# Altium schematic sheet 03_CAN.SchDoc
size A; SheetNumber: 4; SheetTotal: 6
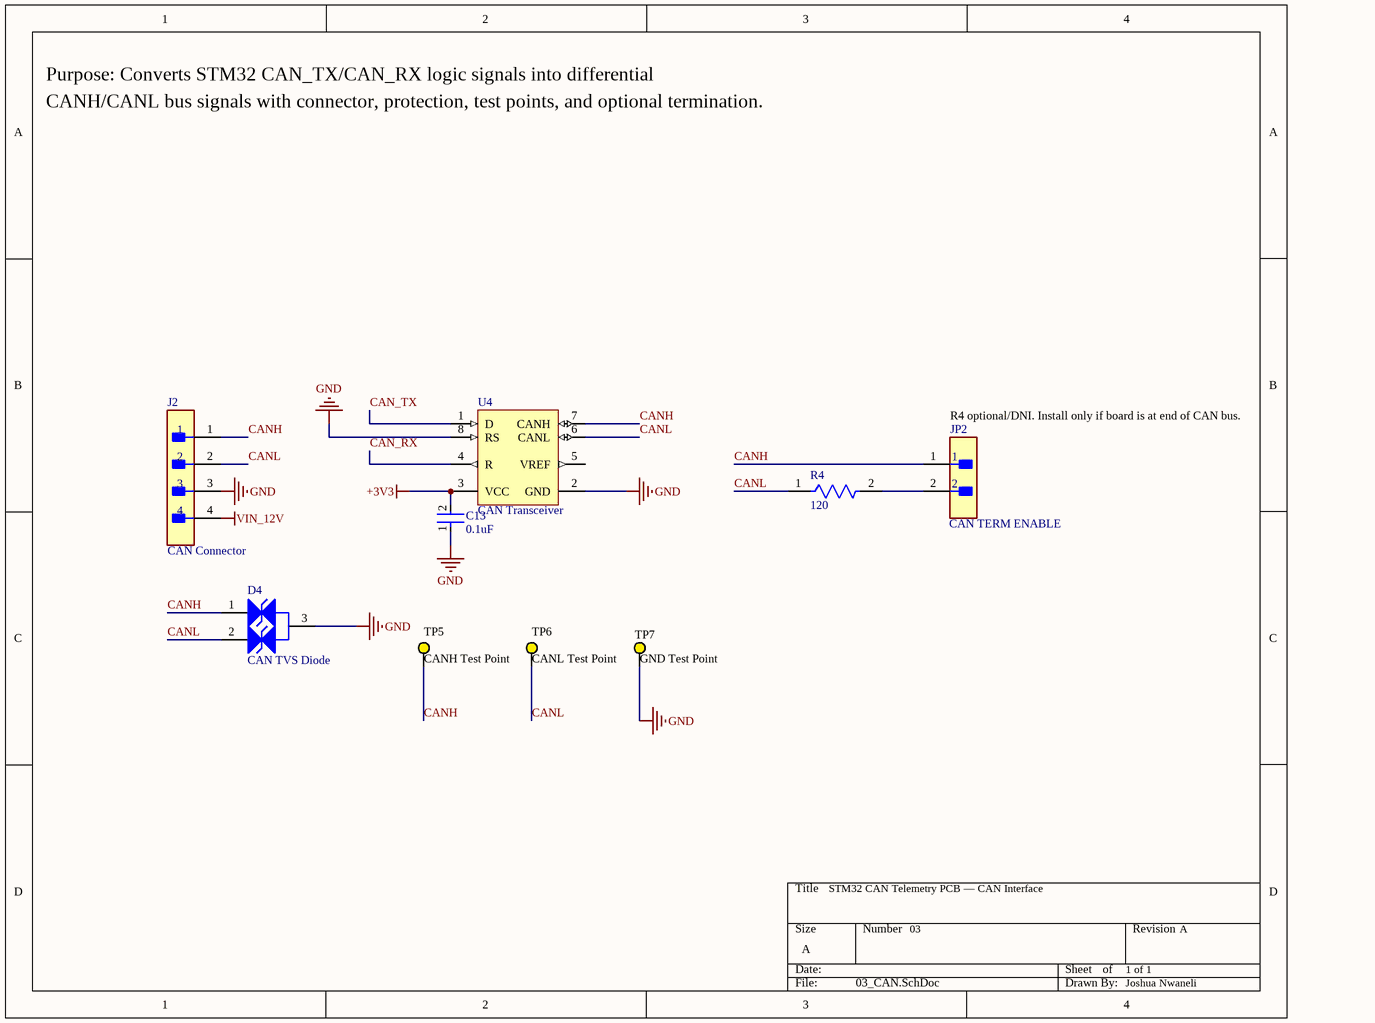
[diagram p0: 03_CAN.SchDoc]

## Parts
C13  0.1uF  [FP-CC0805-EB-MFG]
D4  CAN TVS Diode  [ONSC-SOT-23-3-318-08_V]
J2  CAN Connector  [FP-1777099-MFG]
JP2  CAN TERM ENABLE  [FP-TSW-102-12-T-S-MFG]
R4  120  [FP-RT0805-MFG]
TP5  CANH Test Point  [KSTN-5014_V]
TP6  CANL Test Point  [KSTN-5014_V]
TP7  GND Test Point  [KSTN-5014_V]
U4  CAN Transceiver  [D0008A_M]

## Nets
+3V3: C13.2 U4.3(VCC)
GND: C13.1 D4.3(K) J2.3 TP7.1 U4.2(GND) U4.8(RS)
VIN_12V: J2.4
CAN_RX: U4.4(R)
CAN_TX: U4.1(D)
CANH: D4.1(K) J2.1 JP2.1 TP5.1 U4.7(CANH)
CANL: D4.2(K) J2.2 R4.1 TP6.1 U4.6(CANL)
NetJP2_2: JP2.2 R4.2

Not connected (* = marked no-connect by the designer): U4 5(VREF)

## Notes on the sheet
- Purpose: Converts STM32 CAN_TX/CAN_RX logic signals into differential
- CANH/CANL bus signals with connector, protection, test points, and optional termination.
- Type @ to refer to a designator
- (near JP2) R4 optional/DNI. Install only if board is at end of CAN bus.
- STM32 CAN Telemetry PCB — CAN Interface
- 03
- 1 of 1
- A
- Joshua Nwaneli

## Library data of the parts
C13 = CMP-00621-107850848-1: CC0805KKX7RYBB104 Capacitor Ceramic 0.01uF 250V X7R 10% 0805 T/R; Capacitance: 100nF; Material: Ceramic; Max Operating Temperature: 125°C; Tolerance: 10%; Case/Package: 0805; NexarPartId: 107850848; Height: 1.45mm; Min Operating Temperature: -55°C; Voltage Rating: 250V
D4 = CMP-1063-00169-1: Dual-line ESD/transient protection for CANH and CANL; Manufacturer: On Semiconductor; PartNumber: SZNUP2105LT3G; V(BR) Min (V): 26.2; Number of Lines: 2; Direction: Bidirectional; Packing: Tape and Reel; C Max (pF): 30; PPK Max (W): 350; IR Max (uA): 0.1; Mounting Technology: Surface Mount; ComponentLink1Description: Manufacturer URL; PackageDescription: 3-Pin Small Outline Transistor, Body 2.92 x 1.3 mm, Pitch 0.95 mm; PackageReference: SOT-23-3-318-08; ComponentLink1URL: http://www.onsemi.com/; PackageVersion: Rev. AP, 11/2009; DatasheetVersion: Rev. 5; RoHS: Pb-Free; ComponentLink2Description: Datasheet; ComponentLink2URL: http://www.onsemi.cn/pub_link/Collateral/NUP2105L-D.PDF; ComponentLink3Description: Package Specification; ComponentLink3URL: http://www.onsemi.cn/pub_link/Collateral/318-08.PDF
J2 = CMP-09399-000012-1: TERM BLOCK HDR 4POS VERT 5.08MM; Number of Levels: 1; Voltage: 300V; Max Current Rating: 12A; Number of Contacts: 4; Connector Type: Plug; Voltage Rating: 250V; Length: 30.48mm; Lead Free: Lead Free; Number of Rows: 1; Package Quantity: 50; Housing Material: Polybutylene; Height: 15.9mm; Color: Green; Termination: Solder; Depth: 8.3mm; Contact Plating: Tin; Flammability Rating: UL94 V-0; Mount: Through Hole; Width: 30.48mm; Packaging: Bulk; Orientation: Straight; Contact Material: Tin; Housing Color: Green; Pitch: 5.08mm; Current Rating: 12A; Current: 12A; Weight: 5.467464oz; Series: MSTBV; Number of Positions Per Level: 4; Number of Positions: 4
JP2 = CMP-02766-001444-1: Jumper to enable optional 120R CAN bus termination; Gender: Male; Number of Contacts: 2; Pitch: 2.54mm; RoHS Compliant: Yes; Mount: Through Hole; Termination: Solder; Packaging: Bulk; Contact Material: Bronze; Contact Plating: Tin; Number of Rows: 1; REACH SVHC: No SVHC; Radiation Hardening: No
R4 = CMP-03412-026588-1: RES SMD 120 OHM 0.5% 1/8W 0805; Manufacturer: Yageo; Manufacturer Part Number: RT0805DRD07120RL; Temperature Coefficient: 25 ppm/°C; Description: RT0805 120Ω 0.125W 25 ppm/°C 1.00%; Tolerance: 0.01; Resistance: 120Ω; Power Rating: 0.125W; Value: 120Ω; Voltage Rating: 150V; Octopart: https://octopart.com/rt0805drd07120rl-yageo-1204488; Digikey Description: RES SMD 120 OHM 0.5% 1/8W 0805; ComponentLink2Description: Datasheet; Device Class L1: Passive Components; Automotive: No; Temperature Range High: +155°C; RoHS: TRUE; Composition: Thin Film; Package: RT0805; Device Class L3: Chip SMD Resistors; Category: Res; Footprint Url: http://www.yageo.com/exep/pages/download/literatures/PYu-R_Mount_10.pdf; Temperature: -55°C to +155°C; Height: 0.6mm; Lead Free: Yes; ComponentLink2URL: http://www.yageo.com/documents/recent/PYu-RT_1-to-0.01_RoHS_L_9.pdf; Series: RT; Temperature Range Low: -55°C; Ipc Land Pattern Name: RESC200125X50; Device Class L2: Resistors
TP5-TP7 = CMP-1672-00006-4: Test Point, Yellow, Through Hole, RoHS, Bulk; Manufacturer: Keystone; PackageDescription: 1-Pin Through Hole Device, Dia 3.17 mm; REACH SVHC: No SVHC; ComponentLink2Description: Datasheet; ComponentLink2URL: http://www.keyelco.com/product-pdf.cfm?p=1323; Package Quantity: 100; Colour: Yellow; Height: 8.12 mm; RoHSCompliant: true; Contact Material: Bronze; Mount: Through Hole; Contact Plating: Silver; ComponentLink1URL: http://www.keyelco.com/; Packaging: Bulk; Mounting Technology: Through Hole; PackageReference: 5014; ComponentLink1Description: Manufacturer URL; DatasheetVersion: Rev. F, 12/2013
U4 = CMP-0315-00046-3: CAN Bus Transceiver, 3.3 V, -40 to 85 degC, 8-Pin SOIC (D), Green (RoHS & no Sb/Br), Tube; PartNumber: SN65HVD230D; Generic Part Number: SN65HVD230; Supply Voltage Min: 3 V; Supply Voltage Max: 3.6 V; ComponentLink2URL: http://www.ti.com/general/docs/lit/getliterature.tsp?genericGeneric Part Number=SN65HVD230&fileType=pdf; DatasheetVersion: SLOS346N; Packing: Tube; Temperature Min: -40 degC; Temperature Max: 85 degC; ComponentLink1Description: Manufacturer URL; Mounting Technology: Surface Mount; RoHS: TRUE; ComponentLink1URL: http://www.ti.com/; ComponentLink2Description: Datasheet; PackageDescription: 8-Pin Plastic Small Outline, Body 4.9 x 3.9 mm, Pitch 1.27 mm